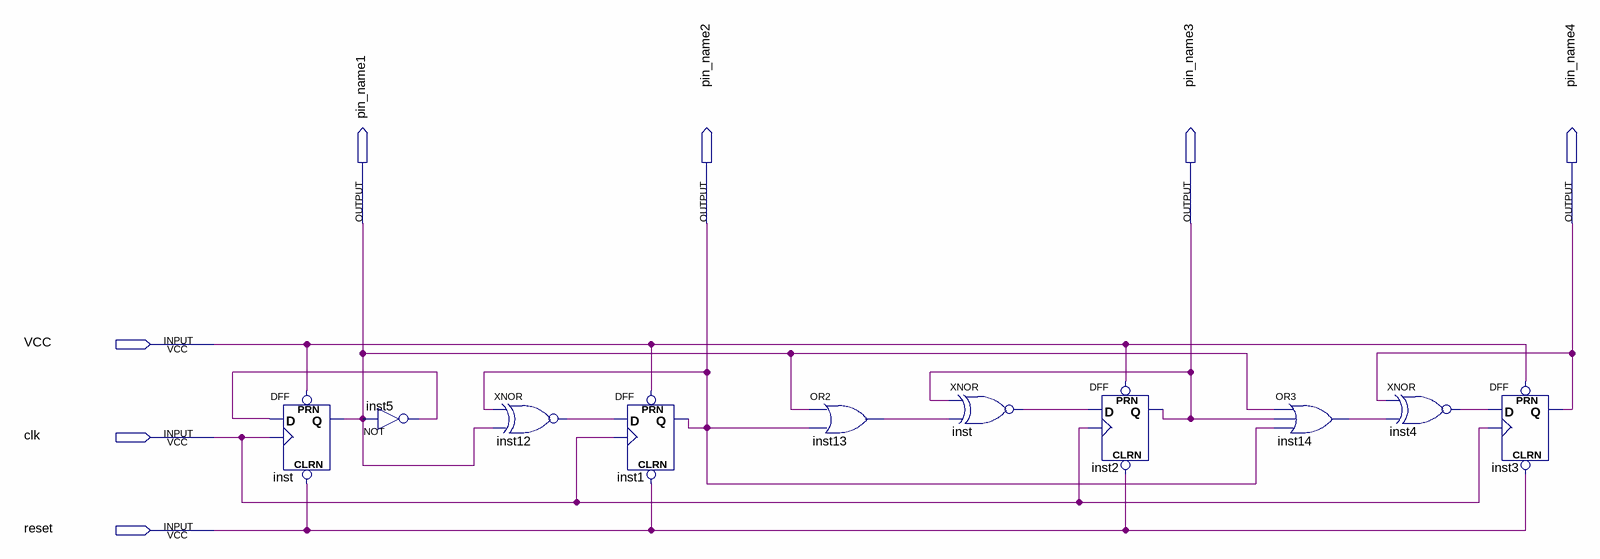
[diagram p0: schematic sheet]
// Quartus schematic modified diagram.bdf as structural Verilog: 10 symbols, 7 pins
module \modified_diagram  (
  input  VCC,
  input  clk,
  input  reset,
  output pin_name1,
  output pin_name2,
  output pin_name3,
  output pin_name4
);

  wire inst4_out, inst5_out, inst12_out, inst13_out, inst14_out, inst_out;

  DFF inst (.CLRN(reset), .CLK(clk), .D(inst5_out), .PRN(VCC), .Q(pin_name1));
  not inst5 (inst5_out, pin_name1);
  xnor inst12 (inst12_out, pin_name2, pin_name1);
  DFF inst1 (.CLRN(reset), .CLK(clk), .D(inst12_out), .PRN(VCC), .Q(pin_name2));
  or inst13 (inst13_out, pin_name1, pin_name2);
  xnor inst_dup2 (inst_out, pin_name3, inst13_out);
  DFF inst2 (.CLRN(reset), .CLK(clk), .D(inst_out), .PRN(VCC), .Q(pin_name3));
  or inst14 (inst14_out, pin_name1, pin_name3, pin_name2);
  xnor inst4 (inst4_out, pin_name4, inst14_out);
  DFF inst3 (.CLRN(reset), .CLK(clk), .D(inst4_out), .PRN(VCC), .Q(pin_name4));
endmodule
